# EAGLE design CMWX_LoRa_GPS_v14_Test (EAGLE 9.5.1)
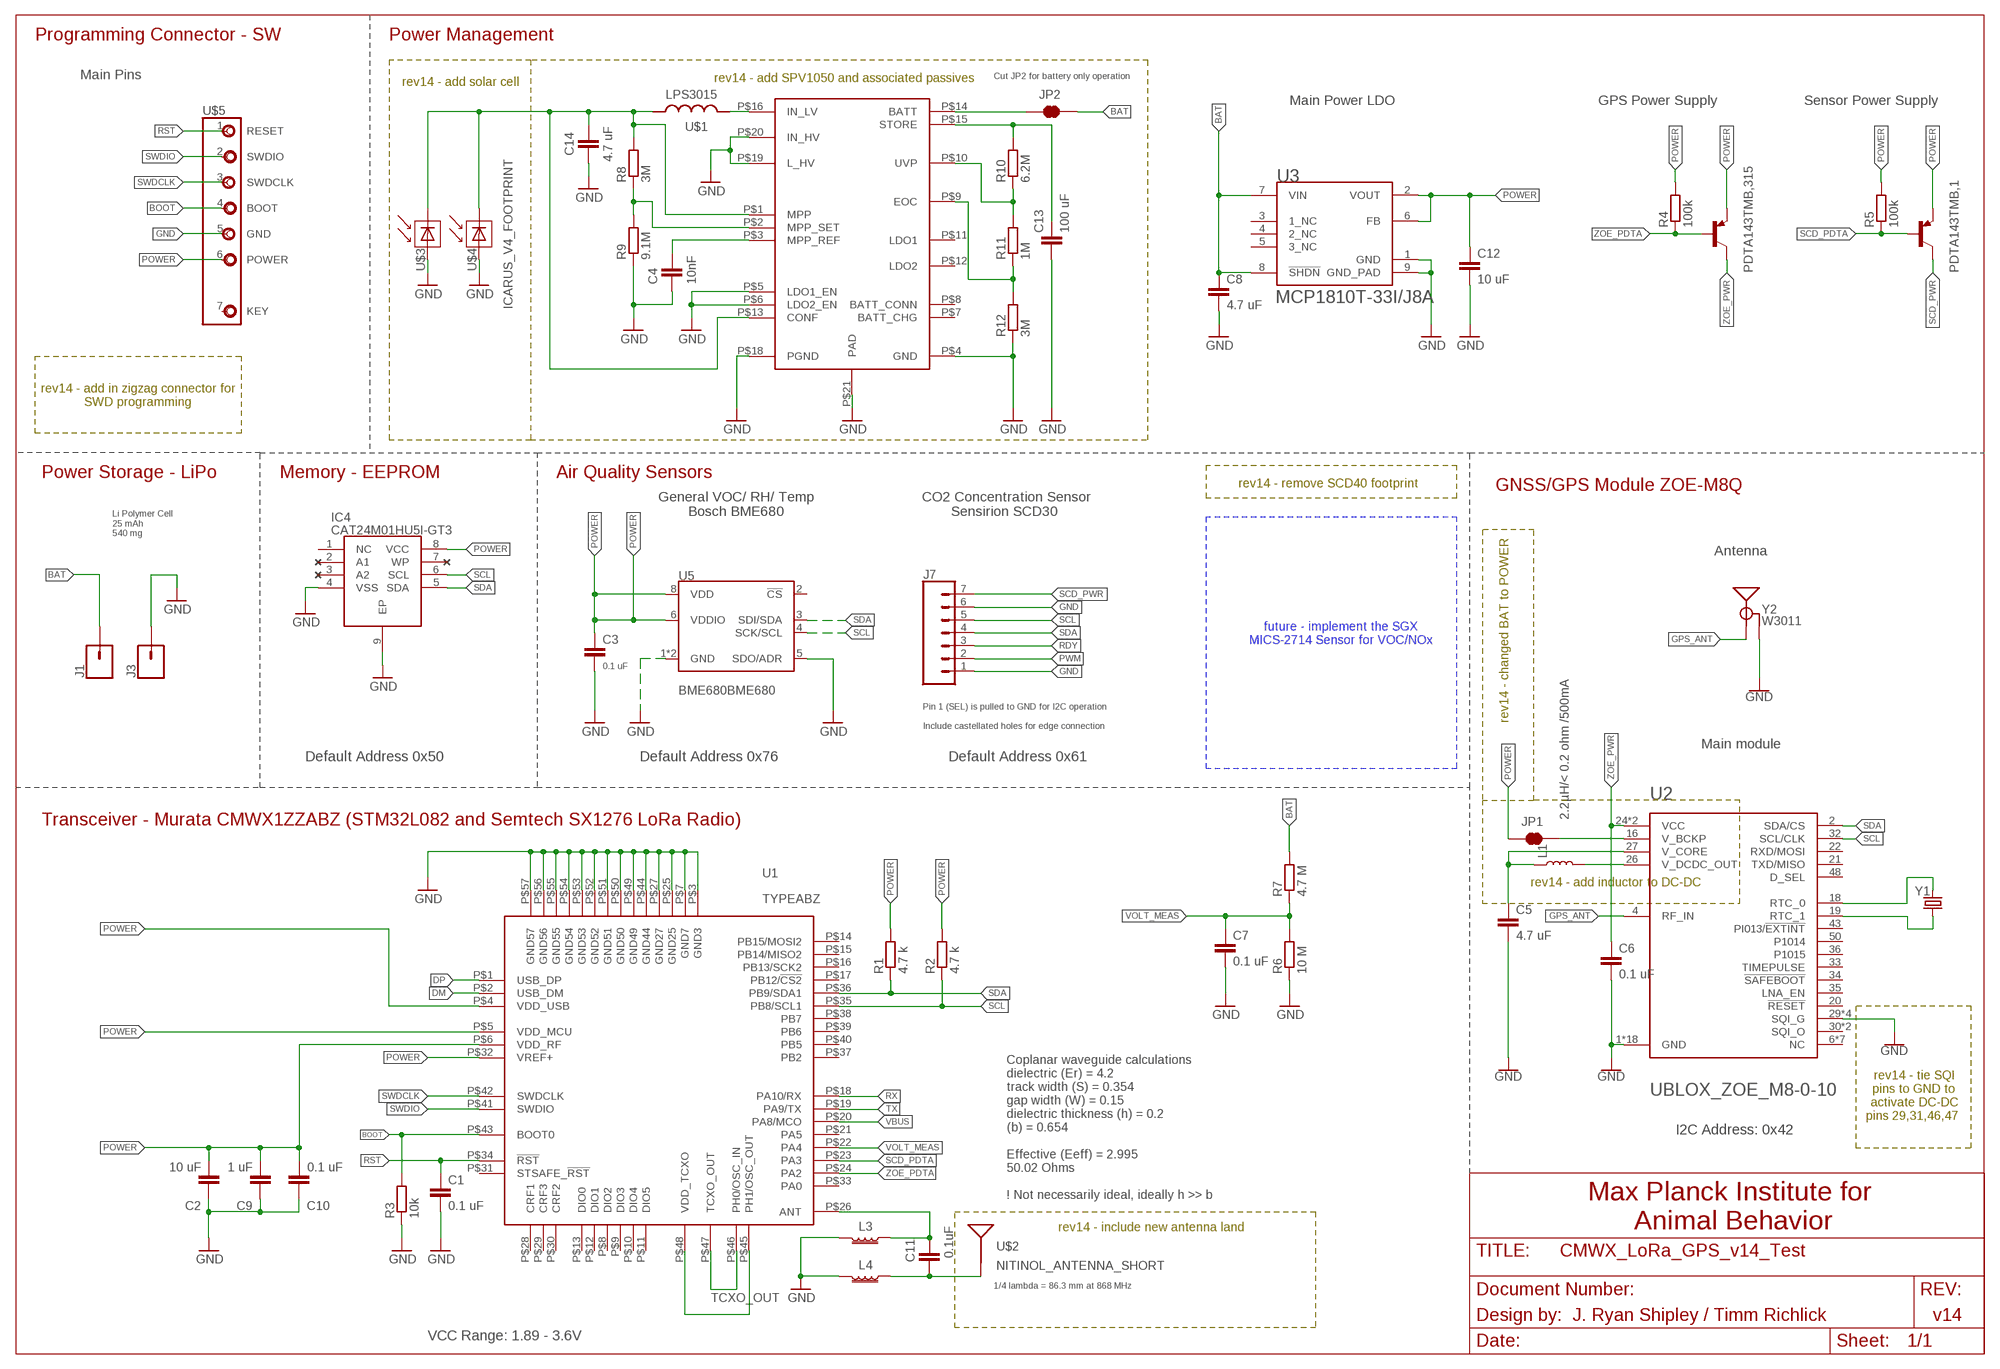
[diagram p0: schematic, sheet 1]

## Parts
C1  0.1 uF  C-EUC0201  [C0201]
C2  10 uF  C-EUC0201  [C0201]
C3  0.1 uF  C-EUC0201  [C0201]
C4  10nF  C-EUC0201  [C0201]
C5  4.7 uF  C-EUC0201  [C0201]
C6  0.1 uF  C-EUC0201  [C0201]
C7  0.1 uF  C-EUC0201  [C0201]
C8  4.7 uF  C-EUC0201  [C0201]
C9  1 uF  C-EUC0201  [C0201]
C10  0.1 uF  C-EUC0201  [C0201]
C11  0.1uF  0.1UF-0402T-16V-10%  [0402-TIGHT]
C12  10 uF  C-EUC0201  [C0201]
C13  100 uF  C-EUC0201  [C0201]
C14  4.7 uF  C-EUC0201  [C0201]
IC4  CAT24M01HU5I-GT3  [SON50P300X200X55-9N]
J1  CONN_01PTH_NO_SILK_YES_STOP  [1X01_NO_SILK]
J3  CONN_01PTH_NO_SILK_YES_STOP  [1X01_NO_SILK]
J7  CONN_07NO_SILK  [1X07_NO_SILK]
JP1  JUMPER-SMT_2_NC_TRACE_NO-SILK  [SMT-JUMPER_2_NC_TRACE_NO-SILK]
JP2  JUMPER-SMT_2_NC_TRACE_NO-SILK  [SMT-JUMPER_2_NC_TRACE_NO-SILK]
L1  2.2µH/< 0.2 ohm /500mA  INDUCTOR-0805-3.3UH  [0805]
L3  FERRITE_BEAD-120_OHM_TIGHT  [0402-TIGHT]
L4  FERRITE_BEAD-120_OHM_TIGHT  [0402-TIGHT]
PDTA143TMB,1  TINYPICO-PNPAMB  [SOT883(B)]
PDTA143TMB,315  TINYPICO-PNPAMB  [SOT883(B)]
R1  4.7 k  R-EU_R0201  [R0201]
R2  4.7 k  R-EU_R0201  [R0201]
R3  10k  R-EU_R0201  [R0201]
R4  100k  R-EU_R0201  [R0201]
R5  100k  R-EU_R0201  [R0201]
R6  10 M  R-EU_R0201  [R0201]
R7  4.7 M  R-EU_R0201  [R0201]
R8  3M  R-EU_R0201  [R0201]
R9  9.1M  R-EU_R0201  [R0201]
R10  6.2M  R-EU_R0201  [R0201]
R11  1M  R-EU_R0201  [R0201]
R12  3M  R-EU_R0201  [R0201]
U1  TYPEABZ  [TYPEABZ]
U2  UBLOX_ZOE_M8-0-10  [UBLOX_ZOE_M8-0-10]
U3  MICROCHIP_MCP1810T-33I-J8AMICROCHIP_MCP1810T-33I-J8A_0_0  [MICROCHIP_MCP1810T-33I-J8A_0]
U4  SPV1050  [SPV1050]
U5  BME680BME680  [LGA3.0X3.0]
U$1  LPS3015  [LPS_3015]
U$2  NITINOL_ANTENNA_SHORT  [ICARUS_NITINOL_ANTENNA_SHORT]
U$3  ICARUS_V4_FOOTPRINT  [ICARUS_FULL_FOOTPRINT]
U$4  ICARUS_V4_FOOTPRINT  [ICARUS_FULL_FOOTPRINT]
U$5  ALBERT_ZIGZAG-ISP  [ALBERT_ZIGZAG-ISP]
Y1  32.768kHz  CRYSTAL-32.768KHZ  [CRYSTAL-SMD-1.0X1.2MM]
Y2  W3011  GPS_CHIP_ANTENNAW3011  [W3011]

## Nets
ANT: C11.1 L4.1 U$2.1(SIGNAL) U$2.2(SIGNAL) U$2.3(SIGNAL)
BAT: C8.1 J1.1 JP2.2 R7.2 U3.7(VIN) U3.8(!SHDN!)
BOOT: R3.2 U1.P$43(BOOT0) U$5.4(BOOT)
DM: U1.P$2(USB_DM)
DP: U1.P$1(USB_DP)
GND: C1.2 C2.1 C3.2 C4.2 C5.2 C6.2 C7.2 C8.2 C9.1 C10.1 C12.2 C13.2 C14.2 IC4.4(VSS) IC4.9(EP) J3.1 J7.1 J7.6 L3.2 L4.2 R3.1 R6.1 R9.1 R12.1 U1.P$3(GND3) U1.P$7(GND7) U1.P$25(GND25) U1.P$27(GND27) U1.P$44(GND44) U1.P$49(GND49) U1.P$50(GND50) U1.P$51(GND51) U1.P$52(GND52) U1.P$53(GND53) U1.P$54(GND54) U1.P$55(GND55) U1.P$56(GND56) U1.P$57(GND57) U2.1(GND) U2.3(GND) U2.5(GND) U2.7(GND) U2.8(GND) U2.9(GND) U2.10(GND) U2.11(GND) U2.12(GND) U2.17(GND) U2.23(GND) U2.29(SQI_G) U2.31(SQI_G) U2.37(GND) U2.38(GND) U2.39(GND) U2.40(GND) U2.41(GND) U2.44(GND) U2.46(SQI_G) U2.47(SQI_G) U2.49(GND) U3.1(GND) U3.9(GND_PAD) U4.P$4(GND) U4.P$5(LDO1_EN) U4.P$6(LDO2_EN) U4.P$18(PGND) U4.P$19(L_HV) U4.P$20(IN_HV) U4.P$21(PAD) U5.1(GND) U5.5(SDO/ADR) U5.7(GND) U$3.P$3(MINUS) U$4.P$3(MINUS) U$5.5(GND) Y2.2(GND) Y2.3(GND)
GPS_ANT [antenna]: U2.4(RF_IN) Y2.1(SIGNAL)
N$1: U1.P$45(PH1/OSC_OUT) U1.P$48(VDD_TCXO)
N$2: JP1.2 U2.16(V_BCKP)
N$3: C5.1 L1.1 U2.27(V_CORE)
N$4: U4.P$16(IN_LV) U$1.P$2
N$5: L1.2 U2.26(V_DCDC_OUT)
N$6: R8.1 R9.2 U4.P$2(MPP_SET)
N$7: C14.1 R8.2 U4.P$1(MPP) U4.P$13(CONF) U$1.P$1 U$3.P$1(PLUS) U$4.P$1(PLUS)
N$8: R10.1 R11.2 U4.P$10(UVP)
N$9: R11.1 R12.2 U4.P$9(EOC)
N$10: JP2.1 U4.P$14(BATT)
N$12: C13.1 R10.2 U4.P$15(STORE)
N$13: C4.1 U4.P$3(MPP_REF)
N$14: U2.18(RTC_0) Y1.P$2
N$15: U2.19(RTC_1) Y1.P$1
N$32: C11.2 L3.1 U1.P$26(ANT)
POWER: C2.2 C3.1 C9.2 C10.2 C12.1 IC4.8(VCC) JP1.1 PDTA143TMB,1.2(E) PDTA143TMB,315.2(E) R1.2 R2.2 R4.2 R5.2 U1.P$4(VDD_USB) U1.P$5(VDD_MCU) U1.P$6(VDD_RF) U1.P$32(VREF+) U3.2(VOUT) U3.6(FB) U5.6(VDDIO) U5.8(VDD) U$5.6(POWER)
PWM: J7.2
RDY: J7.3
RST: C1.1 U1.P$34(!RST) U$5.1(RESET)
RX: U1.P$18(PA10/RX)
SCD_PDTA: PDTA143TMB,1.1(B) R5.1 U1.P$23(PA3)
SCD_PWR: J7.7 PDTA143TMB,1.3(C)
SCL: IC4.6(SCL) J7.5 R2.1 U1.P$35(PB8/SCL1) U2.32(SCL/CLK) U5.4(SCK/SCL)
SDA: IC4.5(SDA) J7.4 R1.1 U1.P$36(PB9/SDA1) U2.2(SDA/CS) U5.3(SDI/SDA)
SWDCLK: U1.P$42(SWDCLK) U$5.3(SWDCLK)
SWDIO: U1.P$41(SWDIO) U$5.2(SWDIO)
TCXO_OUT: U1.P$46(PH0/OSC_IN) U1.P$47(TCXO_OUT)
TX: U1.P$19(PA9/TX)
VBUS: U1.P$20(PA8/MCO)
VOLT_MEAS: C7.1 R6.2 R7.1 U1.P$22(PA4)
ZOE_PDTA: PDTA143TMB,315.1(B) R4.1 U1.P$24(PA2)
ZOE_PWR: C6.1 PDTA143TMB,315.3(C) U2.24(VCC) U2.25(VCC)
Unconnected: IC4.1(NC) IC4.2(A1) IC4.3(A2) IC4.7(WP) U1.P$8(DIO2) U1.P$9(DIO3) U1.P$10(DIO4) U1.P$11(DIO5) U1.P$12(DIO1) U1.P$13(DIO0) U1.P$14(PB15/MOSI2) U1.P$15(PB14/MISO2) U1.P$16(PB13/SCK2) U1.P$17(PB12/!CS2) U1.P$21(PA5) U1.P$28(CRF1) U1.P$29(CRF3) U1.P$30(CRF2) U1.P$31(STSAFE_!RST) U1.P$33(PA0) U1.P$37(PB2) U1.P$38(PB7) U1.P$39(PB6) U1.P$40(PB5) U2.6(NC) U2.13(NC) U2.14(NC) U2.15(NC) U2.20(!RESET) U2.21(TXD/MISO) U2.22(RXD/MOSI) U2.28(NC) U2.30(SQI_O) U2.33(TIMEPULSE) U2.34(!SAFEBOOT) U2.35(LNA_EN) U2.36(P1015) U2.42(NC) U2.43(PI013/!EXTINT) U2.45(SQI_O) U2.48(D_SEL) U2.50(P1014) U2.51(NC) U3.3(1_NC) U3.4(2_NC) U3.5(3_NC) U4.P$7(BATT_CHG) U4.P$8(BATT_CONN) U4.P$11(LDO1) U4.P$12(LDO2) U5.2(!CS) U$5.7(KEY)

## Notes on the sheet
- Programming Connector - SW | Power Management
- rev14 - add SPV1050 and associated passives
- Main Pins | Cut JP2 for battery only operation
- rev14 - add solar cell
- Main Power LDO | GPS Power Supply | Sensor Power Supply
- rev14 - add in zigzag connector for
  SWD programming
- Power Storage - LiPo | Memory - EEPROM | Air Quality Sensors | rev14 - remove SCD40 footprint
- GNSS/GPS Module ZOE-M8Q
- General VOC/ RH/ Temp
  Bosch BME680
- CO2 Concentration Sensor
  Sensirion SCD30
- Li Polymer Cell
  25 mAh
  540 mg
- Antenna
- future - implement the SGX
  MICS-2714 Sensor for VOC/NOx
- Pin 1 (SEL) is pulled to GND for I2C operation
- rev14 - changed BAT to POWER
- Include castellated holes for edge connection
- Main module
- Default Address 0x50 | Default Address 0x76 | Default Address 0x61
- Transceiver - Murata CMWX1ZZABZ (STM32L082 and Semtech SX1276 LoRa Radio)
- rev14 - add inductor to DC-DC
- rev14 - tie SQI 
  pins to GND to 
  activate DC-DC
  pins 29,31,46,47
- I2C Address: 0x42
- Coplanar waveguide calculations
  dielectric (Er) = 4.2
  track width (S) = 0.354
  gap width (W) = 0.15
  dielectric thickness (h) = 0.2
  (b) = 0.654
  
  Effective (Eeff) = 2.995
  50.02 Ohms
  
  ! Not necessarily ideal, ideally h >> b
- Max Planck Institute for 
  Animal Behavior
- rev14 - include new antenna land
- 1/4 lambda = 86.3 mm at 868 MHz
- Design by: | J. Ryan Shipley / Timm Richlick | v14
- VCC Range: 1.89 - 3.6V

## Library data of the parts
C1-C10 C12-C14 = rcl:C-EU: CAPACITOR, European symbol; SPICEPREFIX: C
C11 = SparkFun-Capacitors:0.1UF: 0.1µF ceramic capacitors A capacitor is a passive two-terminal electrical component used to store electrical energy temporarily in an electric field.; PROD_ID: CAP-12416
IC4 = CAT24M01HU5I-GT3-CorrectedV2:CAT24M01HU5I-GT3: EEPROM 1MB I2C SERIAL EEPROM Source: Datasheet <http://www.onsemi.com/pub/Collateral/CAT24M01-D.PDF>; ALLIED_NUMBER: 70300250; ALLIED_PRICE-STOCK: http://www.alliedelec.com/on-semiconductor-cat24m01hu5i-gt3/70300250/; DESCRIPTION: EEPROM 1MB I2C SERIAL EEPROM; HEIGHT: 0.55mm; MANUFACTURER_NAME: ON Semiconductor; MANUFACTURER_PART_NUMBER: CAT24M01HU5I-GT3; MOUSER_PART_NUMBER: 863-CAT24M01HU5I-GT3; MOUSER_PRICE-STOCK: https://www.mouser.com/Search/Refine.aspx?Keyword=863-CAT24M01HU5I-GT3; RS_PART_NUMBER: 7814831P; RS_PRICE-STOCK: http://uk.rs-online.com/web/p/products/7814831P
J1 J3 = SparkFun-Connectors:CONN_01: Single connection point. Often used as Generic Header-pin footprint for 0.1 inch spaced/style header connections On any of the 0.1 inch spaced packages, you can populate with these: Break Away Headers - Straight <https://www.sparkfun.com/products/116> (PRT-00116) Break Away Male Headers - Right Angle <https://www.sparkfun.com/products/553> (PRT-00553) Female Headers <https://www.sparkfun.com/products/115> (PRT-00115) Break Away Headers - Machine Pin <https://www.sparkfun.com/products/117> (PRT-00117) Break Away Female Headers - Swiss Machine Pin <https://www.sparkfun.com/products/743> (PRT-00743) This device is also useful as a general connection point to wire up your design to another part of your project. Our various solder wires solder well into these plated through hole pads. Hook-Up Wire - Assortment (Stranded, 22 AWG) <https://www.sparkfun.com/products/11375> (PRT-11375) Hook-Up Wire - Assortment (Solid Core, 22 AWG) <https://www.sparkfun.com/products/11367> (PRT-11367) View the entire wire category on our website here <https://www.sparkfun.com/categories/141> Special notes: SMTSO-256-ET is a "flush mount" nut for a 4-40 screw. We mostly use this on specialty testbeds; it is a nice way to connect hardware to your PCB at an adjustable hieght. Also note, the SNAP packages are for using a snappable style connector. We sell a baggie of snaps and they are also used on two LilyPad designs: Snap Assortment - 30 pack (male and female) <https://www.sparkfun.com/products/11347> (DEV-11347) LilyPad Arduino SimpleSnap <https://www.sparkfun.com/products/10941> (DEV-10941) LilyPad SimpleSnap Protoboard <https://www.sparkfun.com/products/10940> (DEV-10940)
J7 = SparkFun-Connectors:CONN_07: Multi connection point. Often used as Generic Header-pin footprint for 0.1 inch spaced/style header connections On any of the 0.1 inch spaced packages, you can populate with these: Break Away Headers - Straight <https://www.sparkfun.com/products/116> (PRT-00116) Break Away Male Headers - Right Angle <https://www.sparkfun.com/products/553> (PRT-00553) Female Headers <https://www.sparkfun.com/products/115> (PRT-00115) Break Away Headers - Machine Pin <https://www.sparkfun.com/products/117> (PRT-00117) Break Away Female Headers - Swiss Machine Pin <https://www.sparkfun.com/products/743> (PRT-00743) For SCREWTERMINALS and SPRING TERMINALS visit here: Screw Terimnals on SparkFun.com <https://www.sparkfun.com/search/results?term=Screw+Terminals> (5mm/3.5mm/2.54mm spacing) This device is also useful as a general connection point to wire up your design to another part of your project. Our various solder wires solder well into these plated through hole pads. Hook-Up Wire - Assortment (Stranded, 22 AWG) <https://www.sparkfun.com/products/11375> (PRT-11375) Hook-Up Wire - Assortment (Solid Core, 22 AWG) <https://www.sparkfun.com/products/11367> (PRT-11367) View the entire wire category on our website here <https://www.sparkfun.com/categories/141> Special notes: Molex polarized connector foot print use with SKU : PRT-08231 with associated crimp pins and housings. 1MM SMD Version SKU: PRT-10208 NOTES ON THE VARIANTS LOCK and LOCK_LONGPADS... This footprint was designed to help hold the alignment of a through-hole component (i.e. 6-pin header) while soldering it into place. You may notice that each hole has been shifted either up or down by 0.005 of an inch from it's more standard position (which is a perfectly straight line). This slight alteration caused the pins (the squares in the middle) to touch the edges of the holes. Because they are alternating, it causes a "brace" to hold the component in place. 0.005 has proven to be the perfect amount of "off-center" position when using our standard breakaway headers. Although looks a little odd when you look at the bare footprint, once you have a header in there, the alteration is very hard to notice. Also,if you push a header all the way into place, it is covered up entirely on the bottom side.
JP1 JP2 = SparkFun-Jumpers:JUMPER-SMT_2_NC_TRACE: Normally closed trace jumper This jumper has a trace between two pads so it's normally closed (NC). Use a razor knife to open the connection. For best results follow the IPC guidelines for cutting traces: Cutout at least 0.063 mm (0.005 in). Remove all loose material to clean up the cut area. Seal the cut with an approved epoxy. Reapply solder to reclose the connection.
L1 = SparkFun-Coils:INDUCTOR: Inductors Resist changes in electrical current. Basically a coil of wire. SparkFun Products: SparkFun Load Cell Amplifier - HX711 <https://www.sparkfun.com/products/13879> IOIO-OTG - V2.2 <https://www.sparkfun.com/products/13613>; PROD_ID: NDUC-13076; VALUE: 3.3µH/±20%/450mA
L3 L4 = SparkFun-Coils:FERRITE_BEAD-120_OHM_TIGHT
PDTA143TMB,1 PDTA143TMB,315 = UnexpectedMaker:TINYPICO-PNP: PNP general purpose transistors AAL Eindhoven MK
R1-R12 = rcl:R-EU_: RESISTOR, European symbol; SPICEPREFIX: R
U1 = Kris:TYPEABZ: CMWX1ZZABZ-078
U2 = SparkFun-GPS:UBLOX_ZOE_M8-0-10: UBLOX ZOE-M8Q-0-10 u-blox ZOE-M8 standard precision GNSS SiP (System in Package) modules feature the high performance u-blox M8 GNSS engine. ZOE-M8’s ultra-miniature form factor integrates a complete GNSS receiver including SAW filter, LNA and TCXO. Handles all GNSS systems and can simulatenously use up to three of them, with accuracy ranging from 2.5m to 4m. GPS GLONASS BeiDou Galileo This can be corrected with the SBAS or QZSS augmentation systems.; PROD_ID: IC-14251
U3 = MCP1810:MICROCHIP_MCP1810T-33I-J8A: Ultra-Low Quiescent Current LDO Regulator; CENTROID_NOT_SPECIFIED: No; DATASHEET: http://ww1.microchip.com/downloads/en/DeviceDoc/20005623A.pdf; DIGIKEY_DESCRIPTION: IC REG LINEAR 150MA 8-VDFN; DIGIKEY_PART_NUMBER: MCP1810T-33I/J8ACT-ND; IPC_LAND_PATTERN_NAME: DFN200X200X85-8; LEAD_FREE: yes; MF: Microchip; MFG_PACKAGE_IDENT: C04-3207A; MOUSER_PART_NUMBER: 579-MCP1810T-33I/J8A; MPN: MCP1810T-33I/J8A; PACKAGE: VDFN8; PREFIX: U; ROHS: yes; TEMPERATURE_RANGE_HIGH: +85°C; TEMPERATURE_RANGE_LOW: -40°C
U4 = STM-SPV1050_V2:SPV1050
U5 = SparkFun-Sensors:BME680: Bosch BME680 – Combined Humidity and Pressure Sensor The BME680 is as combined digital humidity, pressure and temperature sensor based on proven sensing principles. The sensor module is housed in an extremely compact metal-lid LGA package with a footprint of only 3.0×3.0mm with a height of 0.93mm. Its small dimensions and its low power consumption allow the implementation in battery driven devices such as handsets, GPS modules or watches.; PROD_ID: IC-14656
U$1 = coilcraft_custom:LPS3015
U$2 = Antenna_mounts:NITINOL_ANTENNA_SHORT
U$3 U$4 = TrisolX_Solar_Cells:ICARUS_V4_FOOTPRINT
U$5 = Zigzag ISP connector:ALBERT_ZIGZAG-ISP
Y1 = SparkFun-Clocks:CRYSTAL-32.768KHZ: 32.768kHz Crystal Frequency: 32.768kHz Frequency Stability: ±20ppm Load Capacitance: 12.5pF (PTH-2X6 & SMD-3.2X1.5), 6pF (SMD-2X6) SparkFun Products: SparkFun BigTime Watch Kit <https://www.sparkfun.com/products/11734> SparkFun nRF52832 Breakout <https://www.sparkfun.com/products/13990> SparkFun Real Time Clock Module <https://www.sparkfun.com/products/12708>; XTAL: SC12S-7PF20PPM
Y2 = SparkFun-GPS:GPS_CHIP_ANTENNA; PROD_ID: ANT-14304

## Net classes
1 vcc: width 0 mm

## Board
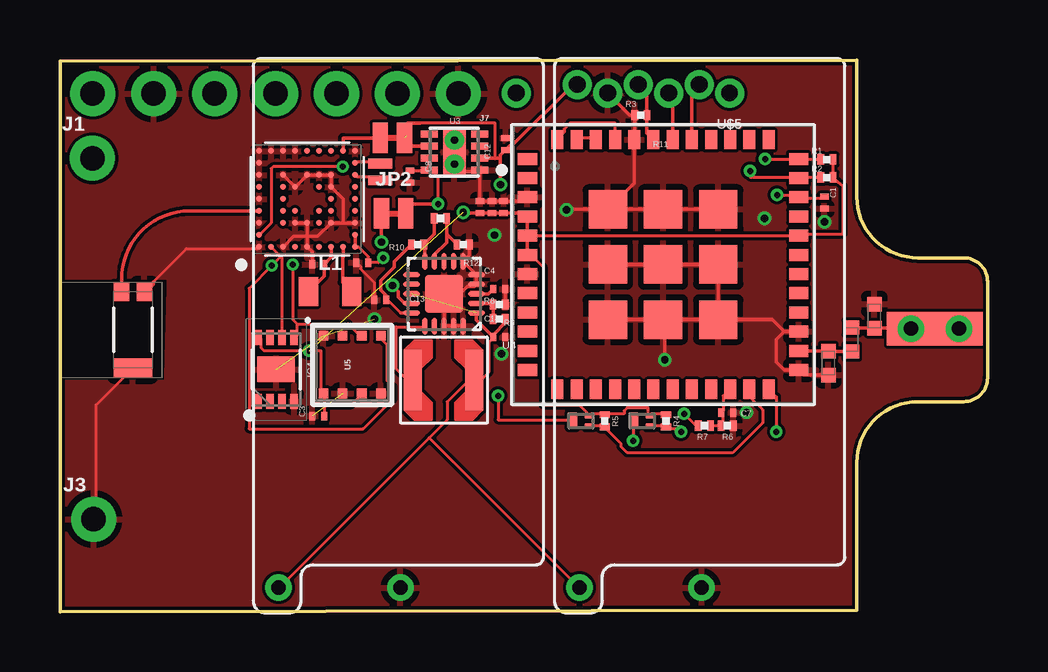
[diagram p1: board, top side]
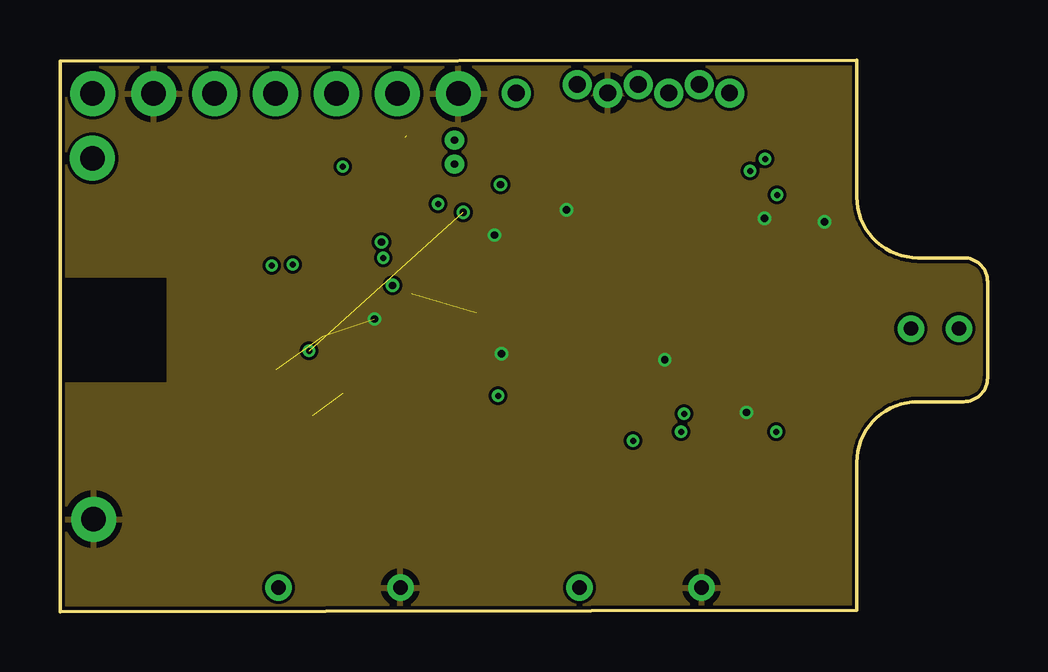
[diagram p2: board, inner layer Route2]
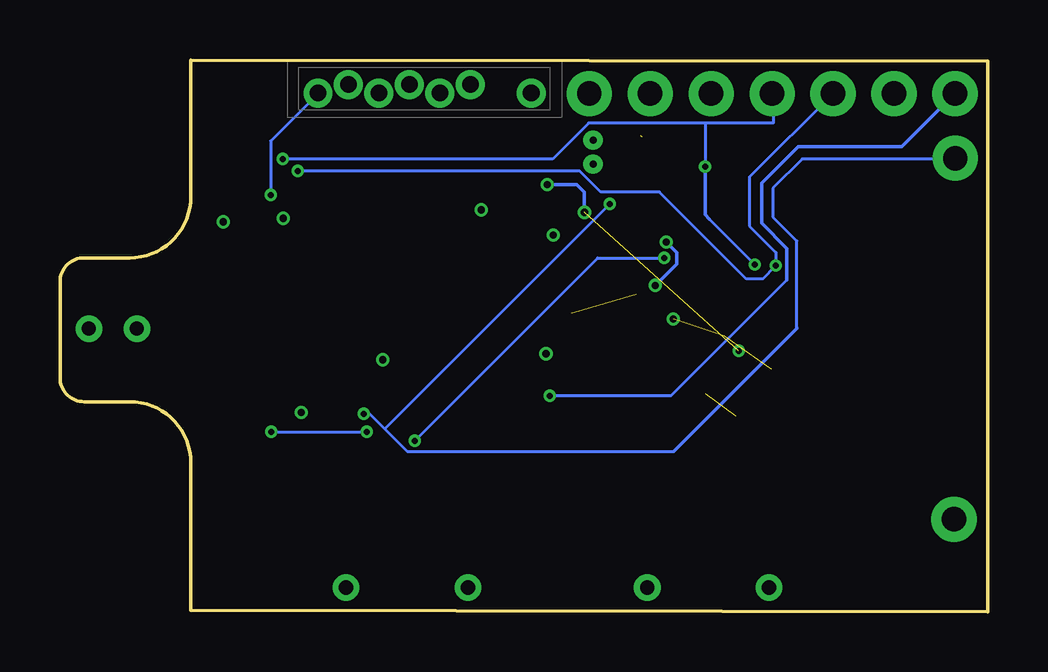
[diagram p3: board, bottom side, seen from below]

Size 38.65 x 23 mm. Coordinates in mm from the lower left corner, seen from the top.
Outline: 0,0 0,22.95 33.2,23 33.2,17.29 arc90 35.74,14.75 37.65,14.75 arc-90 38.65,13.75 38.65,9.75 arc-90 37.65,8.75 35.74,8.75 arc90 33.2,6.21 33.2,0.05 0,0
Copper layers (1+2*15+16): Top 0.035mm / dielectric 0.2mm / Route2 0.035mm / dielectric 0.23mm / Route15 0.035mm / dielectric 0.2mm / Bottom 0.035mm
Design rules "default *": minimum track width 5mil, minimum drill 0.25mm, track to track 5mil, track to pad 5mil, pad to pad 5mil, via to via 5mil, smd to smd 5mil, copper to edge 5mil, drill to drill 3mil, minimum pad ring 10mil, minimum via ring 5mil, stop-mask expansion 4mil, vias tented up to drill 0mil, thermal gap 10mil
tKeepout: area -0.1,7.2 to 6,16.2

### Footprints (pad centres in the part's own frame; a part is rotated, then mirrored left to right if it is on the bottom)
C0201 = smd 0.25 x 0.35: 1 -0.25,0; 2 0.25,0
0402-TIGHT = smd 0.6 x 0.6: 1 -0.5,0; 2 0.5,0
SON50P300X200X55-9N = smd 0.63 x 0.32: 1 -1.33,0.75; 2 -1.33,0.25; 3 -1.33,-0.25; 4 -1.33,-0.75; 5 1.33,-0.75; 6 1.33,-0.25; 7 1.33,0.25; 8 1.33,0.75 | smd 1.06 x 1.56: 9 0,0
1X01_NO_SILK = drill 1.016 pad 1.88: 1 0,0
1X07_NO_SILK = drill 1.016 pad 1.88: 1 0,0; 2 2.54,0; 3 5.08,0; 4 7.62,0; 5 10.16,0; 6 12.7,0; 7 15.24,0
SMT-JUMPER_2_NC_TRACE_NO-SILK = smd 0.635 x 1.27: 1 -0.508,0; 2 0.508,0
0805 = smd 0.8 x 1.2: 1 -0.9,0; 2 0.9,0
SOT883(B) = smd 0.4 x 0.25: 1 -0.35,0.225; 2 -0.35,-0.225 | smd 0.4 x 0.7: 3 0.35,0
R0201 = smd 0.28 x 0.43: 1 -0.255,0; 2 0.255,0
TYPEABZ = smd 0.8 x 0.5: P$1 -5.65,4.4; P$2 -5.65,3.6; P$3 -5.65,2.8; P$4 -5.65,2; P$5 -5.65,1.2; P$6 -5.65,0.4; P$7 -5.65,-0.4; P$8 -5.65,-1.2; P$9 -5.65,-2; P$10 -5.65,-2.8; P$11 -5.65,-3.6; P$12 -5.65,-4.4; P$25 5.65,-4.4; P$26 5.65,-3.6; P$27 5.65,-2.8; P$28 5.65,-2; P$29 5.65,-1.2; P$30 5.65,-0.4; P$31 5.65,0.4; P$32 5.65,1.2; P$33 5.65,2; P$34 5.65,2.8; P$35 5.65,3.6; P$36 5.65,4.4 | smd 0.5 x 0.8: P$13 -4.4,-5.2; P$14 -3.6,-5.2; P$15 -2.8,-5.2; P$16 -2,-5.2; P$17 -1.2,-5.2; P$18 -0.4,-5.2; P$19 0.4,-5.2; P$20 1.2,-5.2; P$21 2,-5.2; P$22 2.8,-5.2; P$23 3.6,-5.2; P$24 4.4,-5.2; P$37 4.4,5.2; P$38 3.6,5.2; P$39 2.8,5.2; P$40 2,5.2; P$41 1.2,5.2; P$42 0.4,5.2; P$43 -0.4,5.2; P$44 -1.2,5.2; P$45 -2,5.2; P$46 -2.8,5.2; P$47 -3.6,5.2; P$48 -4.4,5.2 | smd 1.6 x 1.6: P$49 -2.3,2.3; P$50 0,2.3; P$51 2.3,2.3; P$52 -2.3,0; P$53 0,0; P$54 2.3,0; P$55 -2.3,-2.3; P$56 0,-2.3; P$57 2.3,-2.3
UBLOX_ZOE_M8-0-10 = smd 0.25 x 0.25: 1 -1.996,2.004; 2 -1.496,2.004; 3 -0.996,2.004; 4 -0.496,2.004; 5 0.004,2.004; 6 0.504,2.004; 7 1.004,2.004; 8 1.504,2.004; 9 2.004,2.004; 10 2.004,1.504; 11 2.004,1.004; 12 2.004,0.504; 13 2.004,0.004; 14 2.004,-0.496; 15 2.004,-0.996; 16 2.004,-1.496; 17 2.004,-1.996; 18 1.504,-1.996; 19 1.004,-1.996; 20 0.504,-1.996; 21 0.004,-1.996; 22 -0.496,-1.996; 23 -0.996,-1.996; 24 -1.496,-1.996; 25 -1.996,-1.996; 26 -1.996,-1.496; 27 -1.996,-0.996; 28 -1.996,-0.496; 29 -1.996,0.004; 30 -1.996,0.504; 31 -1.996,1.004; 32 -1.996,1.504; 33 -0.996,1.004; 34 -0.496,1.004; 35 0.004,1.004; 36 0.504,1.004; 37 1.004,1.004; 38 1.004,0.004; 39 1.004,-0.496; 40 1.004,-0.996; 41 0.504,-0.996; 42 0.004,-0.996; 43 -0.496,-0.996; 44 -0.996,-0.996; 45 -0.996,-0.496; 46 -0.996,0.004; 47 -0.996,0.504; 48 -0.496,0.504; 49 0.504,0.504; 50 0.504,-0.496; 51 -0.496,-0.496
MICROCHIP_MCP1810T-33I-J8A_0 = smd 0.7 x 0.3: 1 -1.05,0.75; 2 -1.05,0.25; 3 -1.05,-0.25; 4 -1.05,-0.75; 5 1.05,-0.75; 6 1.05,-0.25; 7 1.05,0.25; 8 1.05,0.75 | smd 0.95 x 1.95: 9 0,0 | drill 0.3 pad 0.6: PAD_1 0,0.5; PAD_2 0,-0.5
SPV1050 = smd 0.7 x 0.2: P$1 -1.35,0.8; P$2 -1.35,0.4; P$3 -1.35,0; P$4 -1.35,-0.4; P$5 -1.35,-0.8; P$11 1.35,-0.8; P$12 1.35,-0.4; P$13 1.35,0; P$14 1.35,0.4; P$15 1.35,0.8 | smd 0.2 x 0.7: P$6 -0.8,-1.35; P$7 -0.4,-1.35; P$8 0,-1.35; P$9 0.4,-1.35; P$10 0.8,-1.35; P$16 0.8,1.35; P$17 0.4,1.35; P$18 0,1.35; P$19 -0.4,1.35; P$20 -0.8,1.35 | smd 1.6 x 1.6: P$21 0,0
LGA3.0X3.0 = smd 0.4 x 0.4: 1 1.2,1.2; 2 1.2,0.4; 3 1.2,-0.4; 4 1.2,-1.2; 5 -1.2,-1.2; 6 -1.2,-0.4; 7 -1.2,0.4; 8 -1.2,1.2
LPS_3015 = smd 0.75 x 2.54: P$1 -1.3,0; P$2 1.25,0
ICARUS_NITINOL_ANTENNA_SHORT = smd 4 x 1.4: 1 0,0 | drill 0.6: 2 -1,0; 3 1,0
ICARUS_FULL_FOOTPRINT = drill 0.6: P$1 5,11.5; P$3 -0.08,11.5
ALBERT_ZIGZAG-ISP = drill 0.7 pad 1.143: 1 0,0.178; 2 1.27,-0.178; 3 2.54,0.178; 4 3.81,-0.178; 5 5.08,0.178; 6 6.35,-0.178; 7 8.89,0.178
CRYSTAL-SMD-1.0X1.2MM = smd 0.4 x 1: P$1 0.35,0; P$2 -0.35,0
W3011 = smd 0.8 x 0.65: 1 1.6,0.475; 2 1.6,-0.475 | smd 0.8 x 1.6: 3 -1.6,0

### Placement (x,y rotation side)
C1  31.85,17.05 270 top
C2  17.5,16.88 270 top
C3  10.75,8.15 180 top
C4  18.3,13.45 0 top
C5  10.75,14.48 180 top
C6  12.6,14.55 180 top
C7  27.8,8.3 0 top
C8  14.58,18.13 270 top
C9  18,16.88 270 top
C10  18.48,16.88 270 top
C11  32.99,11.34 270 top
C12  18.57,19.5 90 top
C13  13.35,13 180 top
C14  18.3,11.45 0 top
IC4  9,10.1 90 top
J1  1.35,18.9 0 top
J3  1.4,3.85 0 top
J7  16.6,21.6 180 top
JP1  13.85,19.75 180 top
JP2  13.9,16.6 0 top
L1  11.25,13.35 0 top
L3  32.01,10.36 270 top
L4  33.93,12.32 90 top
PDTA143TMB,1  21.7,7.95 180 top
PDTA143TMB,315  24.25,7.95 180 top
R1  31.95,18.85 0 top
R2  31.95,18.1 0 top
R3  24.2,20.7 0 top
R4  25.25,7.95 90 top
R5  22.7,7.95 90 top
R6  27.8,7.75 180 top
R7  26.85,7.75 180 top
R8  18.3,12.2 0 top
R9  18.3,12.8 180 top
R10  14.9,15.3 180 top
R11  15.85,16.4 180 top
R12  16.8,15.3 180 top
U1  25.13,14.47 0 top
U2  10.3,17.2 90 top
U3  16.44,19.16 180 top
U4  16,13.25 180 top
U5  12.17,10.29 90 top
U$1  15.95,9.65 180 top
U$2  36.45,11.8 0 top
U$3  26.65,12.5 180 top
U$4  14.1,12.5 180 top
U$5  27.9,21.8 180 top
Y1  13.34,18.33 270 top
Y2  3.04,11.75 90 top

### Tracks (layer width: path | path; a pad name or v marks a point on that pad's centre or on a via)
ANT
  Top 0.127: U$2.2 35.5,11.75 U$2.1 36.5,11.88 37.38,11.88 U$2.3
  Top 0.152: U$2.1 36.43,11.82 L4.1 33.02,11.82 C11.1
BAT  (via drill 0.25)
  Top 0.127: C8.1 14.62,18.38 15.38,18.38 U3.8 | U3.7 15.38,18.88 15.38,18.5 U3.8 | v26,8.25 26.5,7.75 R7.2 | v15.75,17 15.75,18.12 15.5,18.38 U3.8
  Top 0.152: JP2.2 14.41,17 v15.75,17
  Bottom 0.127: v26,8.25 25.75,8.25 25.12,7.62 | 25.12,7.62 24.18,6.67 13.09,6.67 | 7.95,11.85 7.95,15.45 8.95,16.45 8.95,17.65 7.72,18.88 1.25,18.88 J1.1 | 25.12,7.62 v15.75,17
  Bottom 0.152: 13.09,6.67 7.95,11.81 7.95,11.85
BOOT
  Top 0.152: U1.P$43 24.45,19.94 R3.2 24.45,21.61 U$5.4
GND  (via drill 0.3)  (3 unrouted)
  Top 0.127: Y2.2 3.62,13.38 3.88,13.62 3.88,13.75 5.25,15.12 8.25,15.12 U2.1 | Y2.3 3,10.12 1.5,8.62 1.5,3.88 J3.1 | C6.2 12.52,14.38 12.52,14.29 13.09,13.72 13.09,13.29
  Top 0.152: U4.P$20 U4.P$19 U4.P$18 U4.P$21 16.02,13.28 | 16.02,13.28 16.4,13.65 | U2.47 U2.46 10.3,15.65 | 10.3,15.65 U2.29 10.5,15 C5.2 | 10.3,15.65 10.75,15.65 U2.44 11.8,16.2 | 11.8,16.2 U2.23 | 11.8,16.2 11.8,17.2 U2.41 U2.40 U2.39 U2.38 U2.49 U2.37 | 10.3,15.65 9.75,15.65 U2.31 | U1.P$3 19.33,17.12 C10.1 C9.1 C2.1 17.49,17.14 U3.1 17.43,18.35 16.5,18.35 16.5,19.09 U3.9 | L3.2 30.99,9.86 U1.P$25 30.18,10.07 29.85,10.4 29.85,11.35 30.17,11.67 | 30.17,11.67 U1.P$27 | R9.1 C4.2 | 16.02,13.28 16.7,13.28 16.97,13.55 17.25,13.55 U4.P$4 U4.P$5 U4.P$6 17.05,14.86 R12.1 | U$5.5 23.74,20.7 R3.1 23.95,19.69 U1.P$44 23.93,17.87 U1.P$49 | U1.P$57 U1.P$56 | U1.P$57 U1.P$54 U1.P$53 U1.P$52 | U1.P$56 U1.P$55 | U1.P$57 29.67,12.17 30.17,11.67 | v25.2,10.5 25.2,12.1 U1.P$56 | U1.P$49 U1.P$50 U1.P$51 | U1.P$49 21.12,16.77 v21.1,16.75 | 13.09,13.29 13.1,13.28 C13.2
  other vias: 31.85,16.25 18.1,15.7 18.4,10.75 28.6,8.3 29.35,16.4 13.1,12.2
  pour Route2: -1.61,23.6 39.5,23.6 39.5,-0.5 -1.52,-0.48 -1.52,9.5 4.5,9.5 4.5,14 -1.69,14
  pour Top: -0.35,23.25 39.05,23.25 39.05,-0.75 -0.8,-0.75 -0.8,9.6 4.4,9.6 4.4,9.8 4.5,13.5 4.5,13.9 -0.35,13.9
GPS_ANT
  Top 0.152: U2.4 5.4,16.7 arc90 2.56,13.86 Y2.1
N$1
  Top 0.127: U1.P$48 20.75,19.75 21,20 21,20.12 21.25,20.38 23.12,20.38 23.12,19.75 U1.P$45
N$2
  Top 0.152: U2.16 11.8,19.75 13,19.75 13.01,19.75 JP1.2
N$3
  Top 0.152: U2.27 11.3,14.78 C5.1 11,14 L1.1
N$4
  Top 0.127: U4.P$16 15.12,11.88 14,11.88 14,10.12 14.38,9.75 14.62,9.75 U$1.P$2
N$5
  Top 0.152: U2.26 11.8,14.79 11.77,14.76 11.77,13.73 L1.2
N$6
  Top 0.152: U4.P$2 18,12.85 R9.2 R8.1
N$7  (1 unrouted)
  Top 0.127: C14.1 18,11.38 17.88,11.25 17.88,10 17.62,9.75 17.25,9.75 U$1.P$1 17.25,9.62 17,9.62 16.12,8.75 16.12,8 15.38,7.25 | 15.38,7.25 9.12,1 U$4.P$1 | 15.38,7.25 21.62,1 U$3.P$1
  Top 0.152: 17.45,12.45 U4.P$1 17.35,12.15 C14.1 18.07,11.47 18.07,11.56 18.55,12.04 R8.2
N$8
  Top 0.152: R11.2 15.6,15.74 R10.1 15.2,15.26 U4.P$10
N$9
  Top 0.152: R11.1 16.11,15.74 R12.2 | R11.1 16.2,16.4 | U4.P$9 15.6,14.88 16.11,15.38 R11.1
N$10  (via drill 0.3)
  Top 0.152: JP2.1 v13.39,15.41 v13.4,15.4 | 14.34,12.85 U4.P$14 14.37,12.85 14.1,13.12 14.1,13.35 v13.85,13.6
  Bottom 0.152: v13.39,15.41 12.95,14.97 12.95,14.5 v13.85,13.6
N$12
  Top 0.127: 14.2,12.45 13.64,13.01 | R10.2 14.62,15.25
  Top 0.152: 13.64,13.01 C13.1 13.6,13.17 13.37,13.4 13.37,13.8 13.93,14.36 13.93,14.59 R10.2 | 14.2,12.45 U4.P$15
N$13
  Top 0.152: C4.1 17.85,13.25 U4.P$3
N$14
  Top 0.127: U2.18 12.38,18.75 13.25,18.75 Y1.P$2
N$15
  Top 0.127: U2.19 12.38,18.12 13.25,18.12 13.25,18 Y1.P$1
N$32
  Top 0.152: C11.2 32.03,10.84 L3.1 30.79,10.86 U1.P$26
POWER  (via drill 0.25, 0.3)  (2 unrouted)
  Top 0.127: 11,8.62 11,9 U5.8 10.88,9.12 10.88,10.88 v10.38,10.88 8.5,10.88 8.38,11 8.38,11.38 IC4.8 | 11,8.62 C3.1 | 11,8.62 12.12,8.62 12.5,9 U5.6 | R1.2 R2.2 32.62,17.75 32.62,15.75 30.88,15.75 U1.P$32 30.75,15.65 19.5,15.65 U1.P$5 | R4.2 25.25,8.25 24.62,8.25 PDTA143TMB,315.2 24.5,8.25 24.5,8.5 23.62,8.5 23.5,8.38 23.5,8.25 22.75,8.25 R5.2 22.62,8.25 22.12,8.25 PDTA143TMB,1.2 22,8.25 21.62,8.62 20.12,8.62 20.12,14.38 19.5,15 U1.P$6 | 15,20.38 18.12,20.38 18.12,18.91 18.12,18.88 | 15.38,19.45 U3.6
  Top 0.152: U1.P$6 U1.P$5 U1.P$4 19.32,16.62 C10.2 C9.2 C2.2 16.8,16.62 v16.8,16.65 | 18.35,18.91 18.35,19.03 C12.1 18.74,19.42 18.83,19.42 21.39,21.98 U$5.6 | 18.35,18.91 v18.35,17.8 | U3.2 18.12,18.91 18.35,18.91 | 15.34,19.45 U3.6 14.7,19.41 JP1.1 | 14.36,20.08 14.43,20.08 14.45,20.05 14.45,19.84 | 15,20.38 14.48,20.38 14.36,20.25 JP1.1 | 14.38,19.77 JP1.1
  Bottom 0.152: v18.35,17.8 17.12,17.8 16.8,17.48 v16.8,16.65
RST  (via drill 0.25)
  Top 0.127: C1.1 31.7,17.25 30.88,17.25 U1.P$34 30.75,17.38 v29.88,17.38
  Bottom 0.127: v29.88,17.38 29.88,19.62 28,21.5 U$5.1
SCD_PDTA
  Top 0.127: PDTA143TMB,1.1 22.12,7.75 22.62,7.75 R5.1 22.75,7.62 23.38,7 23.38,6.88 23.62,6.62 28.02,6.62 29.27,7.88 29.27,8.42 28.73,8.97 U1.P$23
SCD_PWR  (via drill 0.25)
  Top 0.127: v18.25,9 18.25,8 21.25,8 PDTA143TMB,1.3
  Bottom 0.127: v18.25,9 13.2,9 8.38,13.82
  Bottom 0.152: J7.7 3.57,19.39 7.88,19.39 9.42,17.86 9.42,16.19 8.37,15.14 8.37,14.24 8.38,14.23 8.38,13.82
SCL  (via drill 0.25)
  Top 0.127: 9.25,14.75 9.25,11.5 IC4.6 | U2.32 8.88,15.12 9.2,14.8 v8.82,14.43 7.88,13.47 7.88,7.62 12.62,7.62 13.88,8.88 13.88,9.38 13.62,9.62 13.62,11.12 13.38,11.38 U5.4 | R2.1 31.57,18.12 30.88,18.12 U1.P$35 30.75,18.12 28.75,18.12 v28.75,18.38
  Bottom 0.127: v28.75,18.38 17,18.38 16.12,17.5 13.68,17.5 10.05,13.88 9.38,13.88 v8.82,14.43 8.82,14.97 9.93,16.07 9.93,18.11 J7.5
SDA  (via drill 0.25)
  Top 0.127: 9.88,12 12,12 12.5,11.5 U5.3 | 9.88,12 9.88,11.5 IC4.5 | R1.1 31.57,18.88 30.88,18.88 U1.P$36 30.75,18.88 v29.38,18.88 | U2.2 8.8,16.2 8.8,18.48 8.88,18.55 v11.78,18.55 | 9.88,12 9.7,12.18 v9.7,14.47
  Bottom 0.127: 11.78,20.38 v11.78,18.55 | J7.4 8.93,21.55 8.93,20.38 11.78,20.38 | v29.38,18.88 18.12,18.88 16.62,20.38 11.78,20.38 | v9.7,14.47 11.6,16.38
  Bottom 0.152: 11.6,16.38 11.78,16.55 v11.78,18.55
SWDCLK
  Top 0.152: U$5.3 25.53,21.45 U1.P$42
SWDIO
  Top 0.152: U1.P$41 26.33,21.68 U$5.2
TCXO_OUT
  Top 0.127: U1.P$47 21.62,19.75 22.25,19.75 U1.P$46
VOLT_MEAS
  Top 0.127: R7.1 R6.2 27.62,7.75 27.62,8.25 C7.1 27.62,8.38 27.62,9 27.88,9.25 U1.P$22
ZOE_PDTA  (via drill 0.25)
  Top 0.127: PDTA143TMB,315.1 24.62,7.75 25.25,7.75 R4.1 25.25,7.62 25.88,7.62 v25.88,7.5 | U1.P$24 29.85,8.95 v29.85,7.5
  Bottom 0.127: v29.85,7.5 v25.88,7.5
ZOE_PWR  (via drill 0.25)
  Top 0.127: U2.25 12.45,15.2 12.85,14.8 C6.1 13.28,14.55 v13.47,14.75 | v23.88,7.12 23.88,7.88 PDTA143TMB,315.3
  Top 0.152: U2.24 U2.25
  Bottom 0.127: v13.47,14.75 16.25,14.75 v23.88,7.12